# EAGLE design clvHd_EMG (EAGLE 9.6.2)
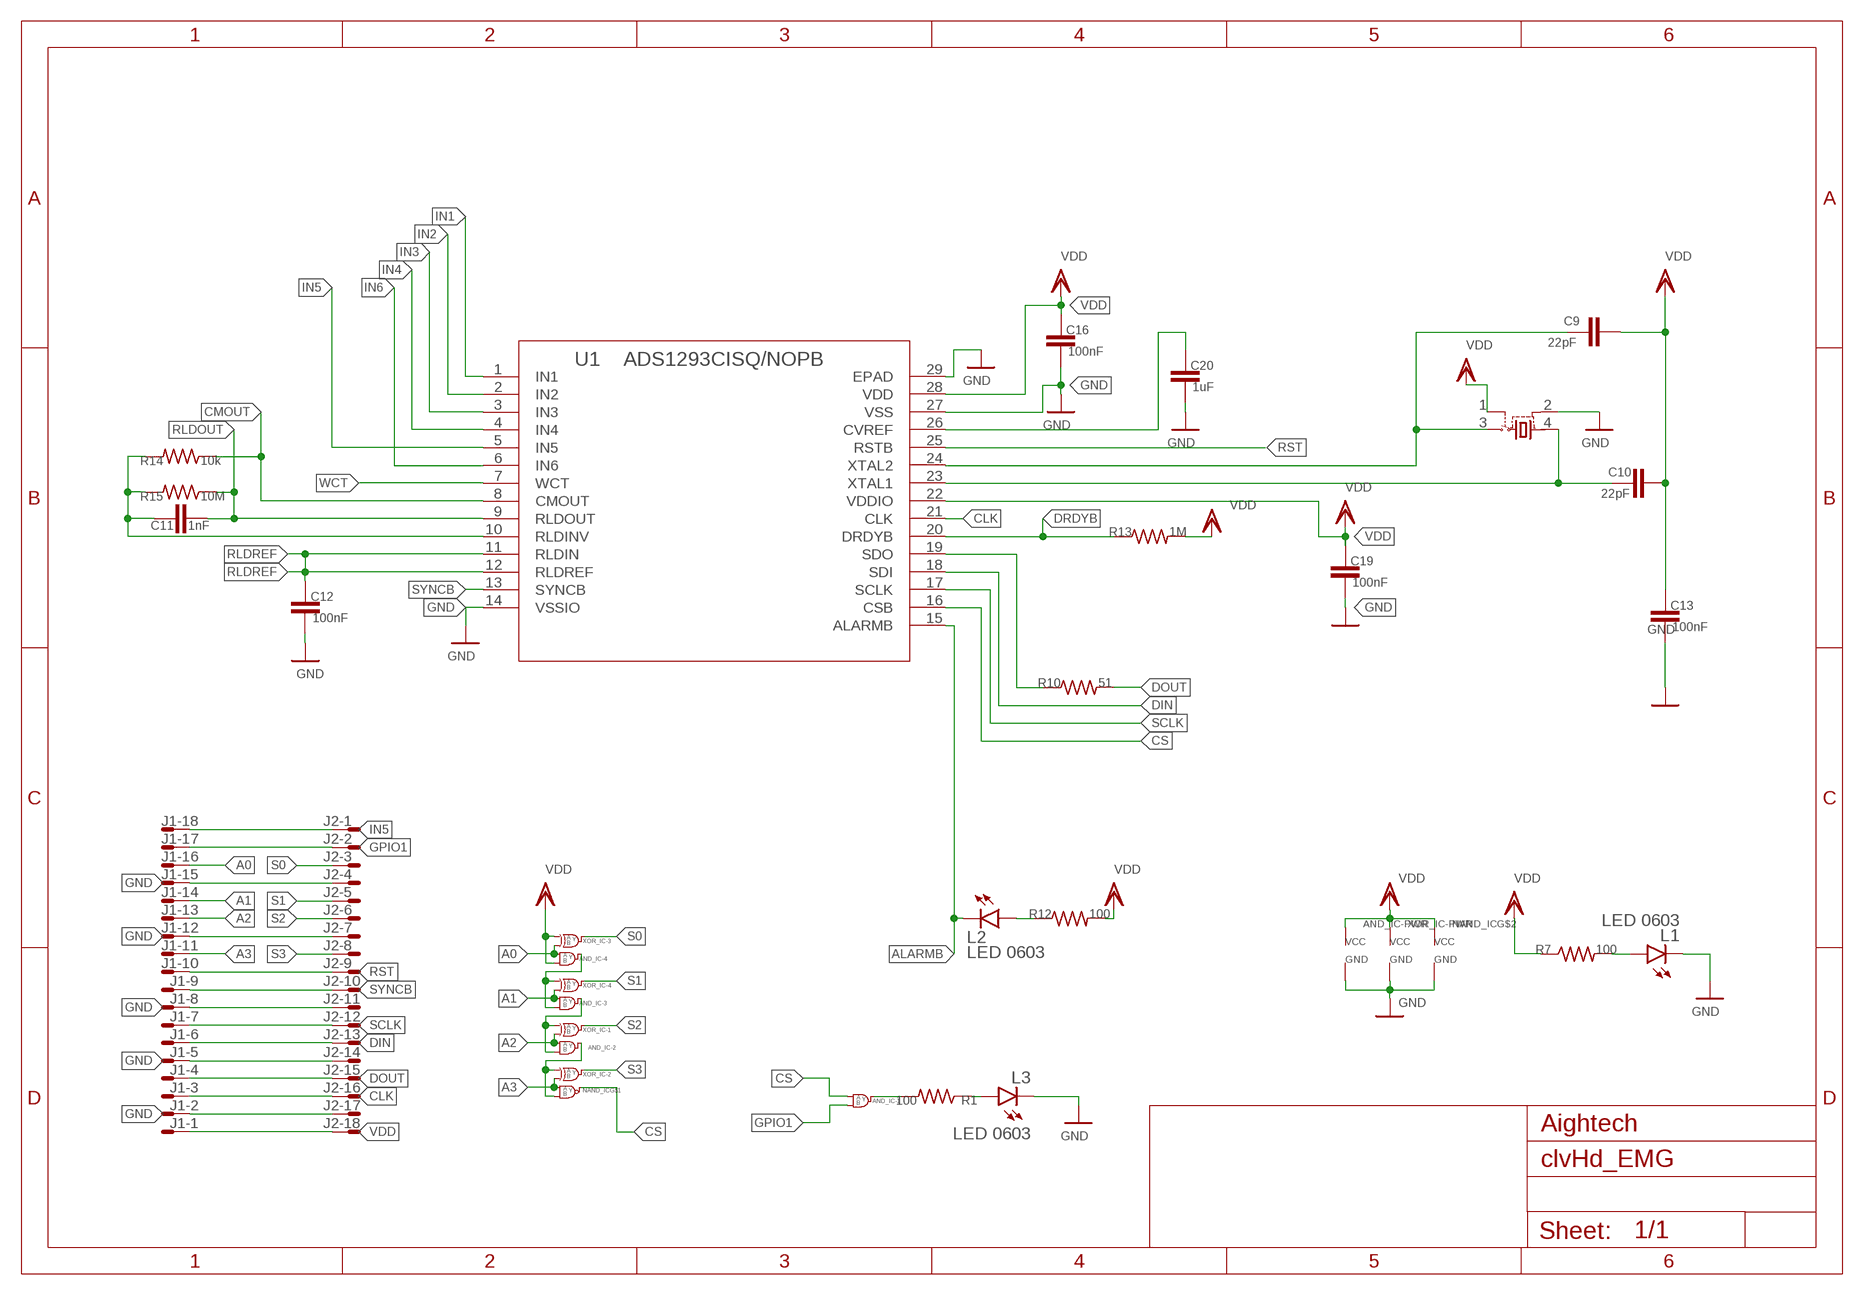
[diagram p0: schematic, sheet 1]

## Parts
AND_IC  SN74ALVC08LARGE  [SN74LVC86ARGYR]
C9  22pF  C-EUC0402  [C0402]
C10  22pF  C-EUC0402  [C0402]
C11  1nF  C-EUC0402  [C0402]
C12  100nF  C-EUC0402  [C0402]
C13  100nF  C-EUC0402  [C0402]
C16  100nF  C-EUC0402  [C0402]
C19  100nF  C-EUC0402  [C0402]
C20  1uF  C-EUC0402  [C0402]
J1  XF2J-1824-12  [XF2J-1824-12]
J2  XF2J-1824-12  [XF2J-1824-12]
L1  LED 0603  LEDCHIP-LED0603  [CHIP-LED0603]
L2  LED 0603  LEDCHIP-LED0603  [CHIP-LED0603]
L3  LED 0603  LEDCHIP-LED0603  [CHIP-LED0603]
NAND_IC  SN74LVC1G132DCKT  [SOT65P210X110-5N]
R1  100  R-US_R0402  [R0402]
R7  100  R-US_R0402  [R0402]
R10  51  R-US_R0402  [R0402]
R12  100  R-US_R0402  [R0402]
R13  1M  R-US_R0402  [R0402]
R14  10k  R-US_R0402  [R0402]
R15  10M  R-US_R0402  [R0402]
U1  ADS1293CISQ/NOPB  [RSG28_3P6X3P6_TEX]
U$1  C387328  C387328  [SMD-3225_4P]
XOR_IC  SN74LVC86A  [SN74LVC86ARGYR]

## Nets
A0: AND_IC.12(-4:A) J1.16 XOR_IC.10(-3:B)
A1: AND_IC.9(-3:A) J1.14 XOR_IC.13(-4:B)
A2: AND_IC.4(-2:A) J1.13 XOR_IC.2(-1:B)
A3: J1.11 NAND_IC.1(A) XOR_IC.5(-2:B)
ALARMB: L2.C U1.15(ALARMB)
CLK: J1.3 J2.16 U1.21(CLK)
CMOUT: R14.1 U1.8(CMOUT)
CS: AND_IC.1(-1:A) NAND_IC.4(Y) U1.16(CSB)
DIN: J1.6 J2.13 U1.18(SDI)
DOUT: J1.4 J2.15 R10.2
DRDYB: R13.1 U1.20(DRDYB)
GND: AND_IC.7(-PWR:GND) AND_IC.15(-PWR:GND) C12.2 C13.2 C16.2 C19.2 C20.2 J1.2 J1.5 J1.8 J1.12 J1.15 J2.4 J2.7 J2.11 J2.14 J2.17 L1.C L3.C NAND_IC.3(GND) U1.14(VSSIO) U1.27(VSS) U1.29(EPAD) U$1.2(GND) XOR_IC.7(-PWR:GND) XOR_IC.15(-PWR:GND)
GPIO1: AND_IC.2(-1:B) J1.17 J2.2
IN1: U1.1(IN1)
IN2: U1.2(IN2)
IN3: U1.3(IN3)
IN4: U1.4(IN4)
IN5: J1.18 J2.1 U1.5(IN5)
IN6: U1.6(IN6)
N$2: L1.A R7.2
N$3: R10.1 U1.19(SDO)
N$4: C10.2 U1.23(XTAL1) U$1.4(VDD)
N$5: AND_IC.3(-1:Y) R1.2
N$6: L2.A R12.1
N$7: L3.A R1.1
N$8: C9.2 U1.24(XTAL2) U$1.3(OUT)
N$9: C20.1 U1.26(CVREF)
N$11: AND_IC.10(-3:B) AND_IC.11(-4:Y) XOR_IC.12(-4:A)
N$13: AND_IC.5(-2:B) AND_IC.8(-3:Y) XOR_IC.1(-1:A)
N$15: C11.1 R14.2 R15.2 U1.10(RLDINV)
N$16: AND_IC.6(-2:Y) NAND_IC.2(B) XOR_IC.4(-2:A)
RLDOUT: C11.2 R15.1 U1.9(RLDOUT)
RLDREF: C12.1 U1.11(RLDIN) U1.12(RLDREF)
RST: J1.10 J2.9 U1.25(RSTB)
S0: J2.3 XOR_IC.8(-3:Y)
S1: J2.5 XOR_IC.11(-4:Y)
S2: J2.6 XOR_IC.3(-1:Y)
S3: J2.8 XOR_IC.6(-2:Y)
SCLK: J1.7 J2.12 U1.17(SCLK)
SYNCB: J1.9 J2.10 U1.13(SYNCB)
VDD: AND_IC.13(-4:B) AND_IC.14(-PWR:VCC) C9.1 C10.1 C13.1 C16.1 C19.1 J1.1 J2.18 NAND_IC.5(VCC) R7.1 R12.2 R13.2 U1.22(VDDIO) U1.28(VDD) U$1.1(TRI) XOR_IC.9(-3:A) XOR_IC.14(-PWR:VCC)
WCT: U1.7(WCT)

## Notes on the sheet
- Aightech

## Library data of the parts
AND_IC = SamacSys_Parts:SN74ALVC08
C9-C13 C16 C19 C20 = rcl:C-EU: CAPACITOR, European symbol; SPICEPREFIX: C
J1 J2 = con-omron:XF2*-18?: OMRON FPC Connector Source : http://www.omron.com/ecb/products/pdf/fpc.pdf; OC_FARNELL: unknown; OC_NEWARK: unknown
L1-L3 = led:LED: LED OSRAM: - CHIPLED LG R971, LG N971, LY N971, LG Q971, LY Q971, LO R971, LY R971 LH N974, LH R974 LS Q976, LO Q976, LY Q976 LO Q996 - Hyper CHIPLED LW Q18S LB Q993, LB Q99A, LB R99A - SideLED LS A670, LO A670, LY A670, LG A670, LP A670 LB A673, LV A673, LT A673, LW A673 LH A674 LY A675 LS A676, LA A676, LO A676, LY A676, LW A676 LS A679, LY A679, LG A679 - Hyper Micro SIDELED® LS Y876, LA Y876, LO Y876, LY Y876 LT Y87S - SmartLED LW L88C, LW L88S LB L89C, LB L89S, LG L890 LS L89K, LO L89K, LY L89K LS L896, LA L896, LO L896, LY L896 - TOPLED LS T670, LO T670, LY T670, LG T670, LP T670 LSG T670, LSP T670, LSY T670, LOP T670, LYG T670 LG T671, LOG T671, LSG T671 LB T673, LV T673, LT T673, LW T673 LH T674 LS T676, LA T676, LO T676, LY T676, LB T676, LH T676, LSB T676, LW T676 LB T67C, LV T67C, LT T67C, LS T67K, LO T67K, LY T67K, LW E67C LS E67B, LA E67B, LO E67B, LY E67B, LB E67C, LV E67C, LT E67C LW T67C LS T679, LY T679, LG T679 LS T770, LO T770, LY T770, LG T770, LP T770 LB T773, LV T773, LT T773, LW T773 LH T774 LS E675, LA E675, LY E675, LS T675 LS T776, LA T776, LO T776, LY T776, LB T776 LHGB T686 LT T68C, LB T68C - Hyper Mini TOPLED® LB M676 - Mini TOPLED Santana® LG M470 LS M47K, LO M47K, LY M47K Source: http://www.osram.convergy.de LUXEON: - LUMILED® LXK2-PW12-R00, LXK2-PW12-S00, LXK2-PW14-U00, LXK2-PW14-V00 LXK2-PM12-R00, LXK2-PM12-S00, LXK2-PM14-U00 LXK2-PE12-Q00, LXK2-PE12-R00, LXK2-PE12-S00, LXK2-PE14-T00, LXK2-PE14-U00 LXK2-PB12-K00, LXK2-PB12-L00, LXK2-PB12-M00, LXK2-PB14-N00, LXK2-PB14-P00, LXK2-PB14-Q00 LXK2-PR12-L00, LXK2-PR12-M00, LXK2-PR14-Q00, LXK2-PR14-R00 LXK2-PD12-Q00, LXK2-PD12-R00, LXK2-PD12-S00 LXK2-PH12-R00, LXK2-PH12-S00 LXK2-PL12-P00, LXK2-PL12-Q00, LXK2-PL12-R00 Source: www.luxeon.com KINGBRIGHT: KA-3528ASYC Source: www.kingbright.com
NAND_IC = SamacSys_Parts:SN74LVC1G132DCKT: Single 2-Input NAND Gate with Schmitt-Trigger Input Source: Datasheet <http://www.ti.com/lit/gpn/SN74LVC1G132>; DESCRIPTION: Single 2-Input NAND Gate with Schmitt-Trigger Input; HEIGHT: 1.1mm; MANUFACTURER_NAME: Texas Instruments; MANUFACTURER_PART_NUMBER: SN74LVC1G132DCKT
R1 R7 R10 R12 R14 R15 = rcl:R-US_: RESISTOR, American symbol; SPICEPREFIX: R
R13 = rclCustom:R-US_: RESISTOR, American symbol; SPICEPREFIX: R
U1 = ADS:ADS1293CISQ/NOPB; BUILT_BY: EMA_UL_Team; MANUFACTURER_PART_NUMBER: ADS1293CISQ/NOPB; SOURCELIBRARY: TI_2016-05-20; VENDOR: Texas Instruments
U$1 = crystalCustom:C387328: 3.3Vdc CMOS SMD CRYSTAL CLOCK OSCILLATOR SOurce: www.abracon.com; OC_FARNELL: unknown; OC_NEWARK: unknown
XOR_IC = SamacSys_Parts:SN74LVC86A

## Board
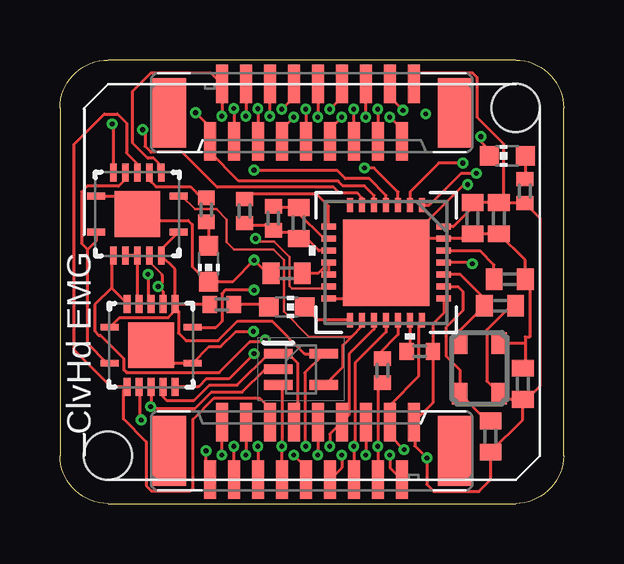
[diagram p1: board, top side]
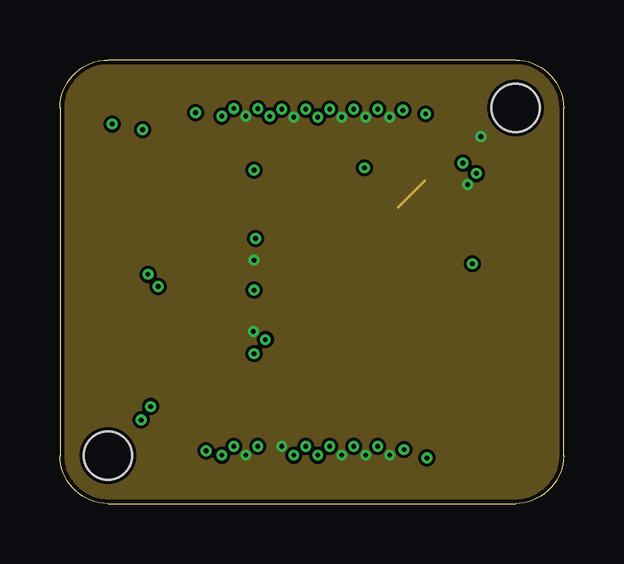
[diagram p2: board, inner layer Route2]
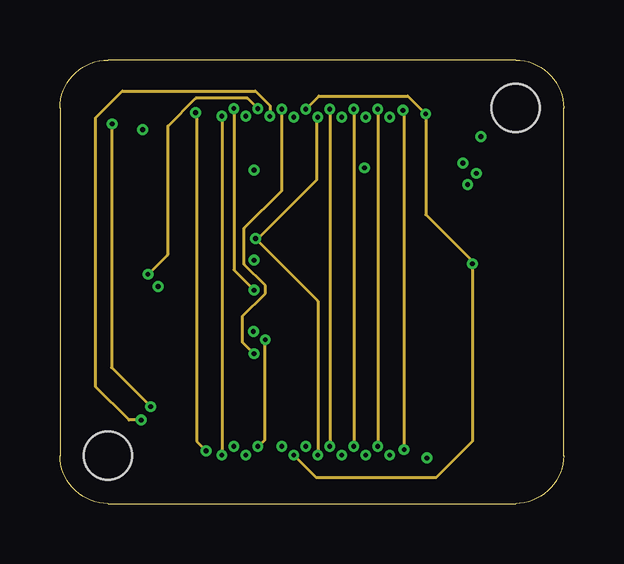
[diagram p3: board, inner layer Route15]
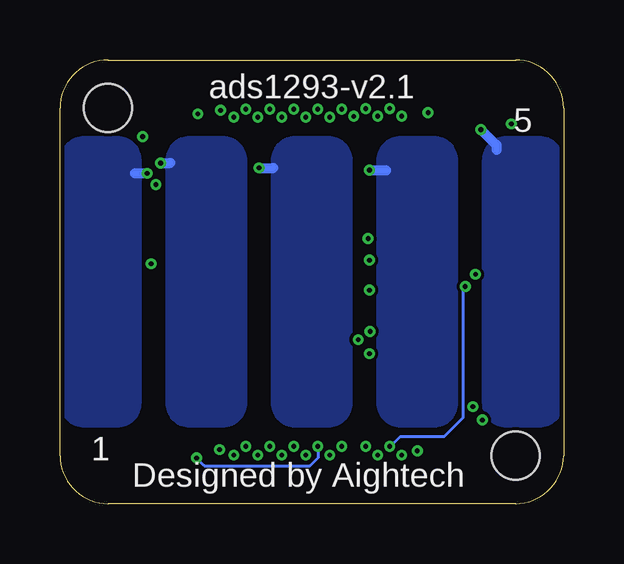
[diagram p4: board, bottom side, seen from below]

Size 21 x 18.5 mm. Coordinates in mm from the lower left corner, seen from the top.
Outline: 0,16.5 0,2 arc90 2,0 19,0 arc90 21,2 21,16.5 arc90 19,18.5 2,18.5 arc90 0,16.5
Copper layers (1*2*15*16): Top 0.035559375mm / dielectric 0.47751875mm / Route2 0.035559375mm / dielectric 0.47751875mm / Route15 0.035559375mm / dielectric 0.47751875mm / Bottom 0.035559375mm
Design rules "SparkFun-4-Layer-Minimum-JLCPCB *": minimum track width 3.5mil, minimum drill 0.2mm, track to track 5mil, track to pad 5mil, pad to pad 5mil, via to via 5mil, smd to smd 5mil, copper to edge 7mil, drill to drill 7mil, minimum pad ring 5mil, minimum via ring 5mil, stop-mask expansion 2.5mil, vias tented up to drill 25mil, thermal gap 10mil
Holes 2 mm at 2,2 19,16.5

### Footprints (pad centres in the part's own frame; a part is rotated, then mirrored left to right if it is on the bottom)
SN74LVC86ARGYR = smd 0.75 x 0.28: 1 -1.725,-0.75; 7 1.725,-0.75; 8 1.725,0.75; 14 -1.725,0.75 | smd 0.28 x 0.75: 2 -1,-1.725; 3 -0.5,-1.725; 4 0,-1.725; 5 0.5,-1.725; 6 1,-1.725; 9 1,1.725; 10 0.5,1.725; 11 0,1.725; 12 -0.5,1.725; 13 -1,1.725 | smd 1.9 x 1.9: 15 0,0
C0402 = smd 0.7 x 0.9: 1 -0.65,0; 2 0.65,0
XF2J-1824-12 = smd 1.6 x 0.5: 1 -1.2,4.25; 2 1.2,3.75; 3 -1.2,3.25; 4 1.2,2.75; 5 -1.2,2.25; 6 1.2,1.75; 7 -1.2,1.25; 8 1.2,0.75; 9 -1.2,0.25; 10 1.2,-0.25; 11 -1.2,-0.75; 12 1.2,-1.25; 13 -1.2,-1.75; 14 1.2,-2.25; 15 -1.2,-2.75; 16 1.2,-3.25; 17 -1.2,-3.75; 18 1.2,-4.25 | smd 2.9 x 1.4: M1 0,5.95; M2 0,-5.95
CHIP-LED0603 = smd 0.8 x 0.8: A 0,-0.75; C 0,0.75
SOT65P210X110-5N = smd 1.2 x 0.4: 1 -0.95,0.65; 2 -0.95,0; 3 -0.95,-0.65; 4 0.95,-0.65; 5 0.95,0.65
R0402 = smd 0.6 x 0.7: 1 -0.5,0; 2 0.5,0
R0402' = smd 0.6 x 0.7: 1 -0.55,0; 2 0.55,0
RSG28_3P6X3P6_TEX = smd 0.6 x 0.25: 1 -2.4,1.5; 2 -2.4,1; 3 -2.4,0.5; 4 -2.4,0; 5 -2.4,-0.5; 6 -2.4,-1; 7 -2.4,-1.5; 15 2.4,-1.5; 16 2.4,-1; 17 2.4,-0.5; 18 2.4,0; 19 2.4,0.5; 20 2.4,1; 21 2.4,1.5 | smd 0.25 x 0.6: 8 -1.5,-2.4; 9 -1,-2.4; 10 -0.5,-2.4; 11 0,-2.4; 12 0.5,-2.4; 13 1,-2.4; 14 1.5,-2.4; 22 1.5,2.4; 23 1,2.4; 24 0.5,2.4; 25 0,2.4; 26 -0.5,2.4; 27 -1,2.4; 28 -1.5,2.4 | smd 3.6 x 3.6: 29 0,0
SMD-3225_4P = smd 0.9 x 0.65: 1 -1.05,-0.825; 2 1.05,-0.825; 3 1.05,0.825; 4 -1.05,0.825

### Placement (x,y rotation side)
AND_IC  3.23,12.07 180 top
C9  18.35,8.25 180 top
C10  17.95,2.8 90 top
C11  9.95,11.7 90 top
C12  9.45,9.6 180 top
C13  19.3,5 90 top
C16  17.2,11.9 270 top
C19  18.3,11.9 270 top
C20  18.75,9.35 0 top
J1  10.5,2.2 270 top
J2  10.5,16.3 90 top
L1  18.65,14.5 90 top
L2  9.46,8.2 270 top
L3  6.2,10 180 top
NAND_IC  10.05,5.6 0 top
R1  6.1,12.25 90 top
R7  19.39,13.03 90 top
R10  13.45,5.55 270 top
R12  6.75,8.3 180 top
R13  1M  [R0402']  15,6.35 0 top
R14  7.7,12.2 270 top
R15  8.9,11.9 270 top
U1  13.6,10.05 270 top
U$1  17.5,5.64 90 top
XOR_IC  3.8,6.6 0 top

### Tracks (layer width: path | path; a pad name or v marks a point on that pad's centre or on a via)
A0  (via drill 0.2)
  Top 0.1: AND_IC.12 3.81,10.27 3.81,10 4.25,9.56 4.25,9.53
  Top 0.127: J1.16 v7.25,2.38 | XOR_IC.10 4.3,8.85 v4.1,9.05 4.25,9.2 4.25,9.53
  Bottom 0.127: v4.1,9.05 4.2,8.95 4.2,3.57 4.97,2.8 6.8,2.8 7.22,2.38 v7.25,2.38
A1  (via drill 0.2)
  Top 0.127: J1.14 v8.25,2.38 | XOR_IC.13 2.8,8.35 2.15,9 | 2.15,9 2.15,10.28 AND_IC.9 | 2.15,9 1.45,8.3 1.45,7.19 1.62,7.02 1.69,7.02 2.66,6.05 2.66,5.57 2.77,5.46 6.64,5.46 7.91,6.73 8.46,6.73 v8.56,6.83
  Route15 0.127: v8.56,6.83 v8.55,6.82 8.55,2.65 8.28,2.38 v8.25,2.38
A2
  Top 0.127: J1.13 8.59,3.56 8.59,4.13 8.32,4.4 6.43,4.4 5.55,3.52 5.55,0.65 5.44,0.54 3.81,0.54 3.6,0.75 3.6,2.58 2.65,3.52 2.65,4.72 XOR_IC.2 2.12,4.88 0.6,6.4 0.6,15 1.85,16.25 2.4,16.25 2.78,15.87 2.78,14.62 3.23,14.18 AND_IC.4
A3
  Top 0.127: J1.11 9.9,3.55 9.9,5.87 9.53,6.24 NAND_IC.1 8.7,6.25 7.39,4.94 6.23,4.94 5.59,4.3 4.45,4.3 4.3,4.45 XOR_IC.5
ALARMB
  Top 0.127: U1.15 10.76,7.65 L2.C
CLK  (via drill 0.2)
  Top 0.127: U1.21 14.95,7.5 14.95,5.3 13.75,4.1 J1.3 13.75,2.85 v14.35,2.25 | v14.3,16.4 13.75,16.95 J2.16
  Route15 0.127: v14.35,2.25 14.35,16.35 v14.3,16.4
CMOUT
  Top 0.127: U1.8 11.2,12.4 10.7,12.9 7.9,12.9 R14.1
CS
  Top 0.1: 12.15,6.95 10.39,6.95 9.34,8 9.34,10.16 8.9,10.6 7.25,10.6 6.95,10.9 6.95,11.85 6.53,12.27 5.63,12.27 5.08,12.82
  Top 0.127: NAND_IC.4 11.05,4.95 11.8,5.7 11.8,6.6 12.15,6.95 12.6,7.4 U1.16 | AND_IC.1 5.08,12.82
DIN  (via drill 0.2)
  Top 0.127: U1.18 13.6,7.15 12.31,5.86 12.31,2.44 v12.25,2.38 J1.6 | J2.13 v12.24,16.44 v12.25,16.45
  Route15 0.127: v12.25,16.45 v12.25,2.38
DOUT  (via drill 0.2)
  Top 0.127: R10.2 13.25,4.85 v13.25,2.38 J1.4 | v13.25,16.45 J2.15
  Route15 0.127: v13.25,16.45 v13.25,2.38
DRDYB
  Top 0.127: U1.20 14.6,6.5 R13.1
GND  (via drill 0.2)
  Top 0.127: U$1.2 19.4,6.69 | C13.2 19.4,5.75 19.4,6.69 | 19.4,6.69 19.4,6.95 19.6,6.95 19.6,9.15 C20.2 19.4,10.15 C19.2 C16.2 17,11.05 U1.27 14.6,11.05 U1.29 | U1.14 12.1,8.55 U1.29 | v17,13.3 16.85,13.3 U1.29 | C12.2 8.65,9.6 v8.1,10.15 7.2,9.25 L3.C 6.15,9.25 5.52,9.88 5.52,11.64 5.35,11.81 3.49,11.81 AND_IC.15 2.48,12.82 AND_IC.7 | J1.15 v7.75,2.02 | XOR_IC.15 4.55,5.85 XOR_IC.7 6.22,6.55 6.71,6.55 7.33,7.17 v8.06,7.17 | NAND_IC.3 9.25,4.8 v9.25,2.38 J1.12 | J1.5 v12.75,2.02 | v11.75,2.02 11.75,1.5 J1.8 | J1.2 13.77,1.48 13.77,2 v13.75,2.02 | v17.55,15.3 17.55,15.1 17.9,14.75 L1.C | J2.4 v7.75,16.15 | 9.25,15.7 J2.7 9.25,15.62 v9.75,16.12 | v11.75,16.12 11.25,15.62 J2.11 | v12.75,16.12 J2.14 | v13.75,16.12 14.25,15.62 J2.17
  Route2 0.127: 15.2,13.45 14.1,12.35
  pour Route2: 0,18.5 21,18.5 21,0 0,0
GPIO1  (via drill 0.2)
  Top 0.127: v6.75,16.15 J2.2 6.31,17.94 3.77,17.94 3.03,17.2 3.03,15.03 3.66,14.4 3.91,14.4 4.11,14.2 4.11,13.92 AND_IC.2 | v6.75,2.02 J1.17
  Route15 0.127: v6.75,16.15 v6.75,2.02
IN1  (via drill 0.2)
  Top 0.127: U1.1 15.4,12.45 16.72,13.77 v17.36,13.77
  Bottom 0.406: v17.36,13.77 17.87,13.77
  pour Bottom: 17.6,4.2 17.6,14.3 arc-90 18.6,15.3 20,15.3 arc-90 21,14.3 21,4.2 arc-90 20,3.2 18.6,3.2 arc-90
IN2  (via drill 0.2)
  Top 0.127: v16.8,14.2 15.8,14.2 14.6,13 U1.2
  Bottom 0.406: v16.8,14.2 16.4,14.2
  pour Bottom: 13.2,4.2 13.2,14.3 arc-90 14.2,15.3 15.6,15.3 arc-90 16.6,14.3 16.6,4.2 arc-90 15.6,3.2 14.2,3.2 arc-90
IN3  (via drill 0.2)
  Top 0.127: U1.3 14.1,13 13.1,14 v12.7,14
  Bottom 0.406: v12.7,14 12.1,14
  pour Bottom: 8.8,4.2 8.8,14.3 arc-90 9.8,15.3 11.2,15.3 arc-90 12.2,14.3 12.2,4.2 arc-90 11.2,3.2 9.8,3.2 arc-90
IN4  (via drill 0.2)
  Top 0.127: U1.4 13.6,12.85 12.9,13.55 11.9,13.55 11.55,13.9 v8.1,13.9
  Bottom 0.406: v8.1,13.9 7.4,13.9
  pour Bottom: 4.4,4.2 4.4,14.3 arc-90 5.4,15.3 6.8,15.3 arc-90 7.8,14.3 7.8,4.2 arc-90 6.8,3.2 5.4,3.2 arc-90
IN5  (via drill 0.2)
  Top 0.127: U1.5 13.1,12.85 12.7,13.25 11.8,13.25 11.6,13.45 7.45,13.45 6.25,14.65 J2.1 6.25,15.7 v5.65,16.3 | J1.18 6.25,1.45 6.1,1.6 v6.1,2.2
  Route15 0.127: v5.65,16.3 5.7,16.25 5.7,2.6 v6.1,2.2
IN6  (via drill 0.2)
  Top 0.127: U1.6 12.6,12.75 12.4,12.95 11.65,12.95 11.41,13.19 6.56,13.19 5.1,14.65 3.8,14.65 3.55,14.9 3.55,15.5 v3.45,15.6
  Bottom 0.406: v3.45,15.6 2.8,14.95 2.8,14.75
  pour Bottom: 0,4.2 0,14.3 arc-90 1,15.3 2.4,15.3 arc-90 3.4,14.3 3.4,4.2 arc-90 2.4,3.2 1,3.2 arc-90
N$2
  Top 0.127: L1.A R7.2
N$3
  Top 0.127: U1.19 14.1,7.05 13.28,6.22 R10.1
N$4
  Top 0.127: U1.23 16.6,9.05 16.8,8.85 16.8,8.05 16.1,7.35 16.1,6.15 16.67,5.58 U$1.4 17.81,3.45 C10.2
N$5
  Top 0.127: AND_IC.3 3.73,13.49 4,13.22 5.44,13.22 5.91,12.75 R1.2
N$6
  Top 0.127: L2.A 8.61,8.3 R12.1
N$7
  Top 0.127: R1.1 6.2,11.65 L3.A
N$8
  Top 0.127: U$1.3 16.67,7.22 C9.2 17.7,8.55 16.7,9.55 U1.24
N$9
  Top 0.127: U1.26 17.5,10.55 18.1,9.95 C20.1
N$11
  Top 0.127: AND_IC.10 AND_IC.11 3.23,8.4 XOR_IC.12
N$13
  Top 0.127: 1.15,10.6 1.15,6.67 1.98,5.85 XOR_IC.1 | 1.15,10.6 0.9,10.85 0.9,13 1.14,13.23 2.44,13.23 2.65,13.45 2.65,13.73 AND_IC.5 | 1.15,10.6 1.5,10.95 AND_IC.8
N$15
  Top 0.127: R14.2 7.8,11.6 8.7,11.6 R15.2 9,11.3 9.7,11.3 C11.1 10.3,11.05 10.8,10.55 U1.10
N$16  (via drill 0.2)
  Top 0.127: NAND_IC.2 8.55,5.6 7.6,4.65 6.33,4.65 5.62,3.95 4.05,3.95 3.8,4.2 | AND_IC.6 2.23,15.79 v2.18,15.83 | XOR_IC.4 3.8,4.2 | 3.8,4.2 3.8,4.06 v3.78,4.04
  Route15 0.127: v3.78,4.04 2.15,5.67 2.15,15.8 v2.18,15.83
RLDOUT
  Top 0.127: U1.9 11,11.05 9.95,12.1 C11.2 8.95,12.35 R15.1
RLDREF
  Top 0.127: U1.12 U1.11 10.75,9.6 C12.1
RST  (via drill 0.2)
  Top 0.127: v17.2,10 17.15,10.05 U1.25 | J1.10 10.25,1.55 10.22,1.55 v9.75,2.02 | v10.25,16.45 J2.9
  Route15 0.127: v10.25,16.45 10.8,17 14.5,17 v15.25,16.25 15.25,12.05 17.25,10.05 v17.2,10 17.2,2.6 15.7,1.1 10.67,1.1 v9.75,2.02
S0  (via drill 0.2)
  Top 0.127: v8.1,8.9 6.9,8.9 6.75,8.75 6.75,7.6 6.5,7.35 XOR_IC.8 | v7.25,16.48 J2.3
  Route15 0.127: v7.25,16.48 7.25,9.75 v8.1,8.9
S1  (via drill 0.2)
  Top 0.127: v8.25,16.47 J2.5 | v3.67,9.56 3.67,8.46 XOR_IC.11
  Route15 0.127: v8.25,16.47 7.82,16.9 5.66,16.9 4.5,15.74 4.5,10.37 4.48,10.37 v3.67,9.56
S2  (via drill 0.2)
  Top 0.127: v8.75,16.15 J2.6 | XOR_IC.3 3.32,4.86 3.32,3.55 v3.38,3.48
  Route15 0.127: v3.38,3.48 2.88,3.48 1.47,4.9 1.47,16.07 2.6,17.2 8.15,17.2 8.75,16.6 v8.75,16.15
S3  (via drill 0.2)
  Top 0.127: v8.1,6.25 7.05,5.2 6.1,5.2 5.78,4.88 XOR_IC.6 | v9.25,16.45 9.75,16.95 J2.8
  Route15 0.127: v8.1,6.25 7.6,6.75 7.6,7.8 8.57,8.77 8.57,9.09 7.68,9.98 7.68,11.48 9.25,13.05 v9.25,16.45
SCLK  (via drill 0.2)
  Top 0.127: U1.17 13.1,7.28 12.06,6.23 12.06,3.71 J1.7 11.25,2.9 v11.25,2.38 | J2.12 11.75,16.95 v11.25,16.45
  Route15 0.127: v11.25,16.45 v11.25,2.38
SYNCB  (via drill 0.2)
  Top 0.1: U1.13 11.2,9 11.17,8.97 9.68,8.97 9.57,9.08 9.57,10.28 8.93,10.92 8.27,10.92 v8.15,11.05
  Top 0.127: J1.9 v10.75,2.02 | J2.10 v10.75,16.12
  Route15 0.127: v10.75,2.02 10.75,8.45 v8.15,11.05 8.25,11.05 10.7,13.5 10.7,16.07 v10.75,16.12
VDD  (via drill 0.2)
  Top 0.127: C9.1 18.8,8.25 17.8,7.25 17.8,5.11 U$1.1 18.56,4.35 C13.1 | U1.28 16.4,11.55 17.2,12.35 C16.1 C19.1 | C19.1 19.37,12.55 R7.1 20.01,11.91 20.01,4.89 19.47,4.35 C13.1 | U1.22 16,7.94 15.55,7.49 R13.2 | C13.1 19.3,3.5 C10.1 17.95,0.98 17.48,0.51 15.59,0.51 15.3,0.8 v15.3,1.9 14.8,2.4 14.8,3.35 J1.1 15.55,4.2 R13.2 | XOR_IC.9 4.8,9.78 AND_IC.13 4.22,10.6 AND_IC.14 | XOR_IC.14 2.48,7.76 4.52,7.76 4.78,8.02 4.78,8.31 XOR_IC.9 | R12.2 4.83,8.3 XOR_IC.9 | XOR_IC.9 4.8,8.17 4.94,8.03 4.94,7.11 5.25,6.8 6.6,6.8 7.41,7.61 8.84,7.61 10.2,6.25 NAND_IC.5 10.2,5.45 10.21,5.44 10.21,2.42 v10.25,2.38 | J2.18 14.75,17.75 14.94,17.94 17.23,17.94 17.39,17.78 17.39,16.11 18.49,15.01 18.49,12.74 C19.1 | R13.2
  Bottom 0.127: v15.3,1.9 14.98,1.58 10.57,1.58 10.25,1.9 v10.25,2.38

### Text on the board
tNames: ClvHd EMG
bNames: ads1293-v2.1 | 5 | 1 | Designed by Aightech